# Altium schematic sheet Output.SchDoc
size A; SheetNumber: 10; SheetTotal: 12
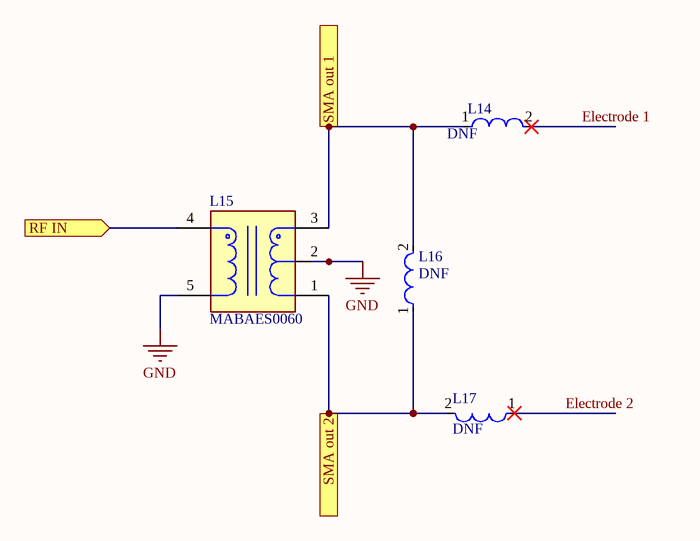
[diagram p0: Output.SchDoc]

## Parts
L14  DNF  [FP-MLZ2012-1_25-IPC_C]
L15  MABAES0060  [FP-MABAES0060-MFG]
L16  DNF  [FP-MLZ2012-1_25-IPC_C]
L17  DNF  [FP-MLZ2012-1_25-IPC_C]

## Ports
RF IN (in), SMA out 1 (out), SMA out 2 (out)

## Nets
GND: L15.2(Secondary_CT) L15.5(Primary)
Electrode 1: L14.2
Electrode 2: L17.1
RF IN: L15.4(Primary_dot) ; port RF IN
SMA out 1: L14.1 L15.3(Secondary_Dot) L16.2 ; port SMA out 1
SMA out 2: L15.1(Secondary) L16.1 L17.2 ; port SMA out 2

## Library data of the parts
L14 L16 L17 = CMP-08253-000383-1: Shielded Multilayer Inductor 1uH ±20% 800mA 130mΩ AEC-Q200 SMD 0805; Core Material: Ferrite; Test Frequency: 2MHz; DC Resistance (DCR): 130mR; Saturation Current: 700mA; Height: 1.25mm; Min Operating Temperature: -55°C; Max DC Current: 800mA; Mount: Surface Mount; Height - Seated (Max): 0.057inch; Tolerance: 20%; Package Quantity: 2000; Case/Package: 0805; Current Rating: 800mA; Inductance: 1uH; Case Code (Metric): 2012; Max Operating Temperature: 125°C; RoHS Compliant: Yes; Case Code (Imperial): 0805; Shielding: Shielded; Ratings: AEC-Q200; Length: 0.079inch; Termination: SMD/SMT; Packaging: Tape and Reel; Width: 0.049inch; Weight: 0.000194oz
L15 = CMP-97513-000003-1: BALUN 300KHZ-200MHZ 1:1 6SMD; Insertion Loss: 1.5dB; Lead/Base Style: Gull Wing; Max DC Current: 500mA; Power Rating: 500mW; Package Quantity: 2000; Lead Free: Lead Free; Case/Package: SMD/SMT; Number of Pins: 5; Width: 3.81mm; Turns Ratio: 1:1; Depth: 3.81mm; Height: 2.67mm; Min Operating Temperature: -40°C; Termination: SMD/SMT; Length: 3.81mm; Max Operating Temperature: 85°C; Packaging: Tape and Reel; Radiation Hardening: No; Mount: Surface Mount